# EAGLE design PiZero-RAK (EAGLE 7.7.0)
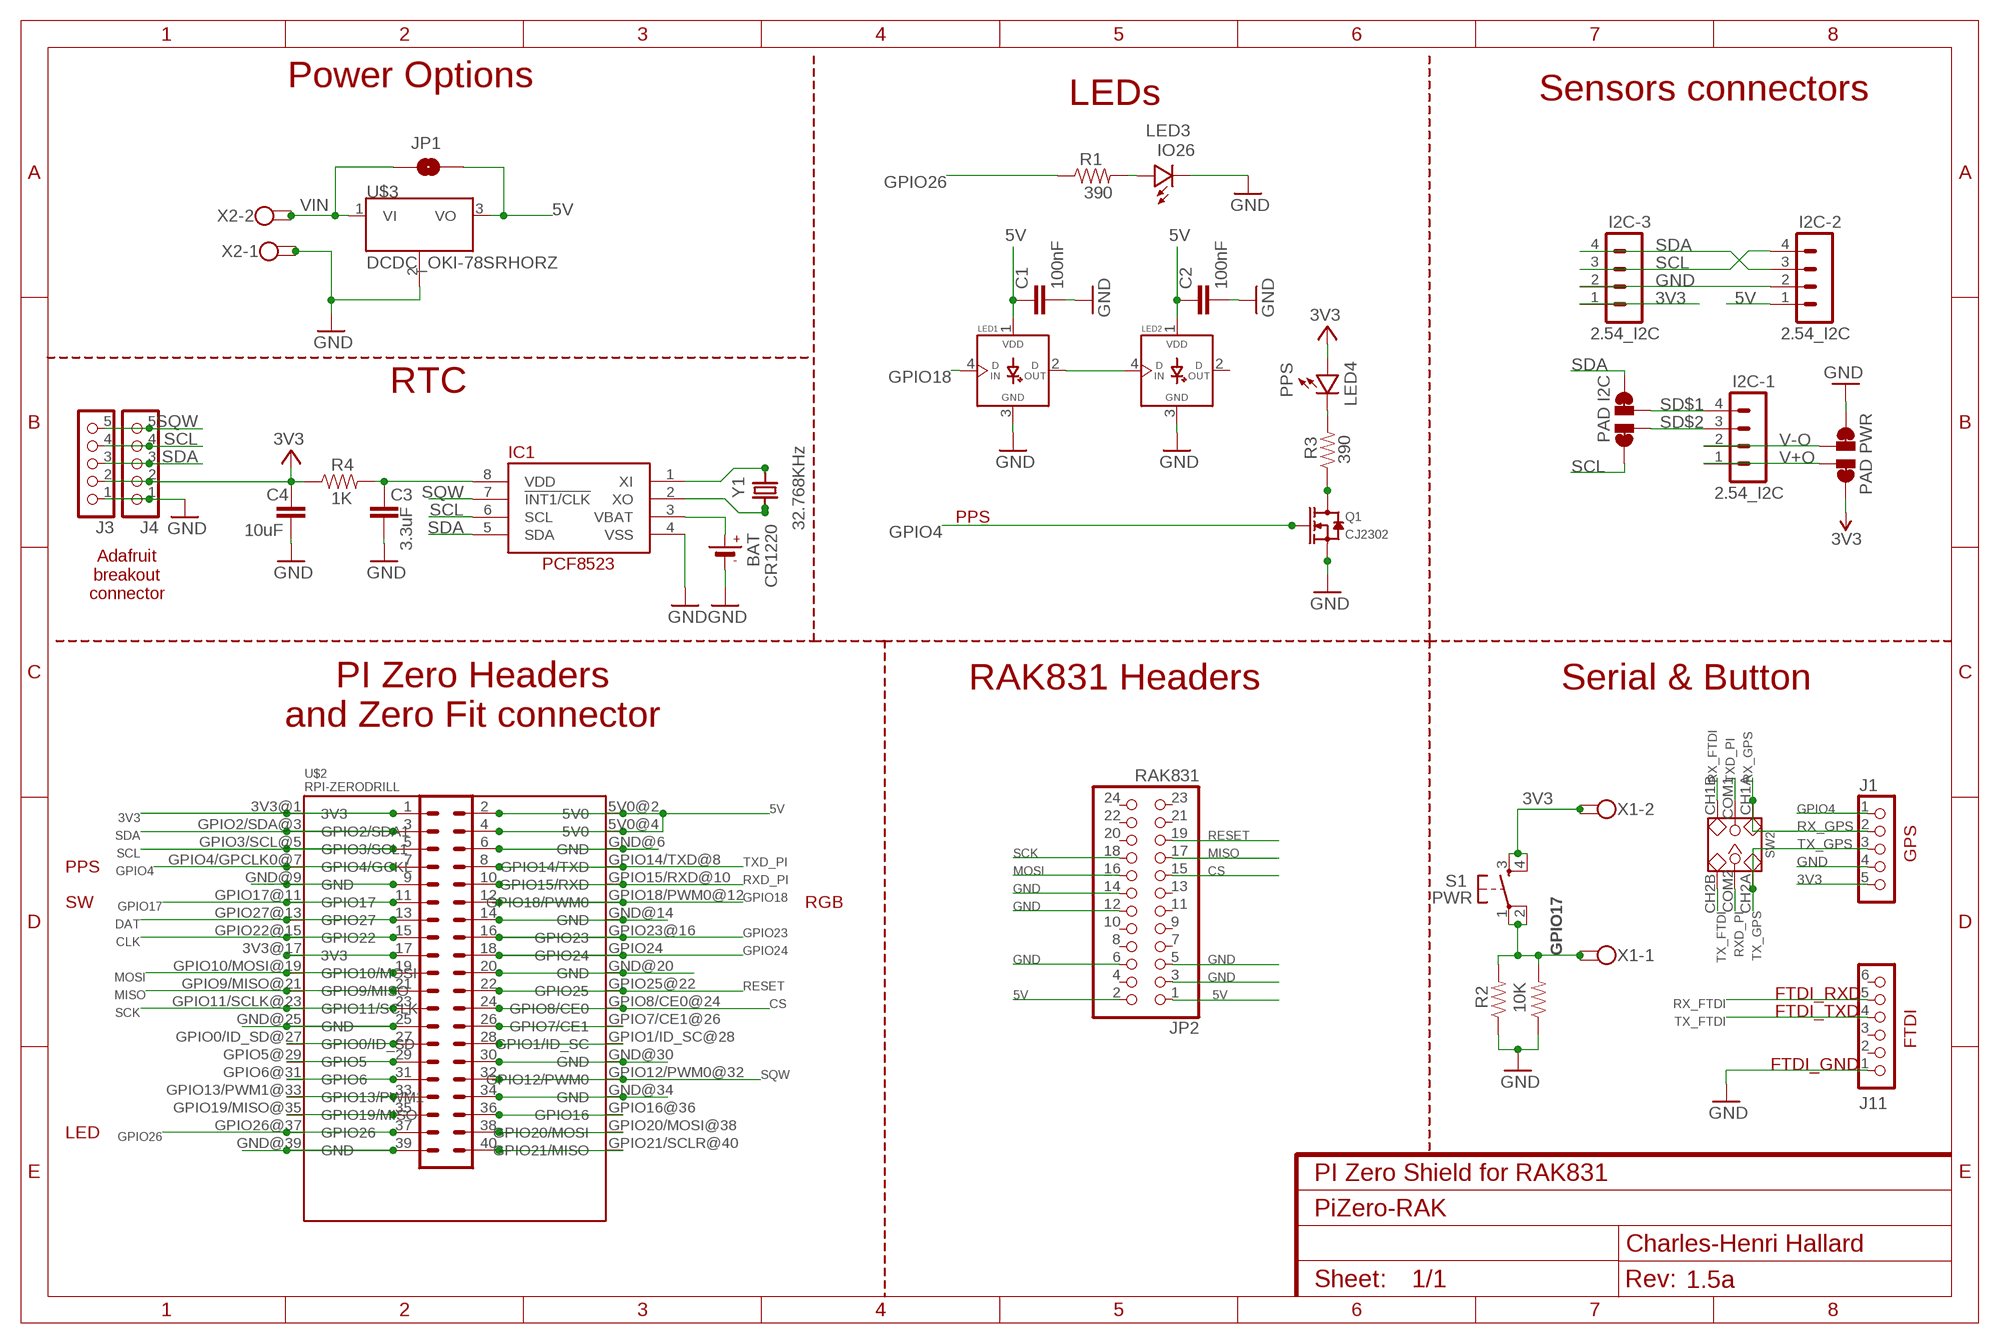
[diagram p0: schematic, sheet 1]
NAME (FRAME-A4L): CNAME: PI Zero Shield for RAK831; CREVISION: 1.5a; DESIGNER: Charles-Henri Hallard

## Parts
BAT  CR1220  BATTERYCR1220_SMT  [CR1220]
C1  100nF  CAP0805-CAP-LARGEPADS  [0805-CAP-LARGEPADS]
C2  100nF  CAP0805-CAP-LARGEPADS  [0805-CAP-LARGEPADS]
C3  3.3uF  CAP0805-CAP-LARGEPADS  [0805-CAP-LARGEPADS]
C4  10uF  CAP0805-CAP-LARGEPADS  [0805-CAP-LARGEPADS]
I2C-1  2.54_I2C  CON_HEADER_1X04'NO_LOCK'  [1X04_NO_LOCK]
I2C-2  2.54_I2C  CON_HEADER_1X04'NO_LOCK'  [1X04_NO_LOCK]
I2C-3  2.54_I2C  CON_HEADER_1X04'NO_LOCK'  [1X04_NO_LOCK]
IC1  PCF8523  RTC_PCF8523T  [SOIC8_150MIL]
J1  CON_HEADER_1X05-PTH  [M1X5]
J2  CONN_20X2HLE  [2X20-HLE]
J3  CON_HEADER_1X05-PTH  [M1X5]
J4  CON_HEADER_1X05-PTH  [M1X5]
J11  CON_HEADER_1X06-PTH  [M1X6]
JP1  JUMPER-PAD-2-NOYES_SILK  [PAD-JUMPER-2-NO_YES_SILK]
JP2  RAK831  PINHD-2X12  [2X12]
LED1  WS2812BLONG  [WS2812B-LONG]
LED2  WS2812BLONG  [WS2812B-LONG]
LED3  IO26  LED0805-LARGE  [0805-LED-LARGEPADS]
LED4  PPS  LED0805-LARGE  [0805-LED-LARGEPADS]
Q1  CJ2302  SMD-MOSFET-N-CH-20V-2.1A-CJ2302(SOT-23)  [SOT-23]
R1  390  RESISTOR0805-RES  [0805-RES]
R2  10K  RESISTORPTH-1/4W  [AXIAL-0.4]
R3  390  RESISTOR0805-RES  [0805-RES]
R4  1K  RESISTOR0805-RES  [0805-RES]
R105  RESISTOR0805-RES  [0805-RES]
S1  PWR  TACTILE-SWITCH-PTH  [TAC-SWITCH-PTH]
SW2  DIP-TOGGLE-SWITCH-2CH-(2X3P-2.54)  [SW6-2.54-9.0X3.5X3.2+2.0MM]
U$2  RPI-ZERODRILL  [RPI-ZERO-DRILLS]
U$3  DCDC_OKI-78SRHORZ  [OKI-78SRH]
U$4  PAD PWR  PAD-JUMPER-SWAPSWAP  [PAD-JUMPER-SWAP]
U$5  PAD I2C  PAD-JUMPER-SWAPSWAP  [PAD-JUMPER-SWAP]
X1  SPTAF_23.5  [FFKV2_35]
X2  SPTAF_25.0MM  [SPTAF_2X50]
Y1  32.768KHz  CRYSTALTC26H  [TC26H]
Y2  CRYSTAL8X3.8SMT  [CRYSTAL_8X3.8]

## Nets
3V3: C4.1 I2C-3.1 J1.5 J2.1 J3.2 J4.2 LED4.PLUS R4.1 S1.3 S1.4 U$2.3V3@1(3V3) U$4.4 U$4.44 X1.2 X1.2A
3V3@17: J2.17 U$2.3V3@17(3V3)
5V: C1.1 C2.1 I2C-2.1 J2.2 J2.4 JP1.2 JP2.1 JP2.2 LED1.1(VDD) LED2.1(VDD) U$2.5V0@2(5V0) U$2.5V0@4(5V0) U$3.3(VO)
CLK: J2.15 U$2.GPIO22@15(GPIO22)
CS: J2.24 JP2.15 U$2.GPIO8/CE0@24(GPIO8/CE0)
DAT: J2.13 U$2.GPIO27@13(GPIO27)
GND: BAT.- C1.2 C2.2 C3.2 C4.2 I2C-2.2 I2C-3.2 IC1.4(VSS) J1.4 J2.6 J2.9 J2.14 J2.20 J2.25 J2.30 J2.34 J2.39 J3.1 J4.1 J11.1 JP2.3 JP2.5 JP2.6 JP2.12 JP2.14 LED1.3(GND) LED2.3(GND) LED3.MINUS Q1.2(S) R2.P$1 R105.1 U$2.GND@6(GND) U$2.GND@9(GND) U$2.GND@14(GND) U$2.GND@20(GND) U$2.GND@25(GND) U$2.GND@30(GND) U$2.GND@34(GND) U$2.GND@39(GND) U$3.2(GND) U$4.1 U$4.11 X2.1 X2.1A
GPIO4: J1.1 J2.7 Q1.1(G) U$2.GPIO4/GPCLK0@7(GPIO4/GCKL)
GPIO17: J2.11 R2.P$2 R105.2 S1.1 S1.2 U$2.GPIO17@11(GPIO17) X1.1 X1.1A
GPIO18: J2.12 LED1.4(DIN) U$2.GPIO18/PWM0@12(GPIO18/PWM0)
GPIO19: J2.35 U$2.GPIO19/MISO@35(GPIO19/MISO)
GPIO23: J2.16 U$2.GPIO23@16(GPIO23)
GPIO24: J2.18 U$2.GPIO24
GPIO26: J2.37 R1.1 U$2.GPIO26@37(GPIO26)
MISO: J2.21 JP2.17 U$2.GPIO9/MISO@21(GPIO9/MISO)
MOSI: J2.19 JP2.16 U$2.GPIO10/MOSI@19(GPIO10/MOSI)
N$14: J2.26 U$2.GPIO7/CE1@26(GPIO7/CE1)
N$16: LED3.PLUS R1.2
N$26: IC1.1(XI) Y1.1 Y2.P$4
N$27: Q1.3(D) R3.1
N$28: J2.28 U$2.GPIO1/ID_SC@28(GPIO1/ID_SC)
N$30: J2.36 U$2.GPIO16@36(GPIO16)
N$31: J2.38 U$2.GPIO20/MOSI@38(GPIO20/MOSI)
N$32: J2.40 U$2.GPIO21/SCLR@40(GPIO21/MISO)
N$33: J2.27 U$2.GPIO0/ID_SD@27(GPIO0/ID_SD)
N$34: J2.29 U$2.GPIO5@29(GPIO5)
N$35: J2.31 U$2.GPIO6@31(GPIO6)
N$36: J2.33 U$2.GPIO13/PWM1@33(GPIO13/PWM1)
N$37: LED4.MINUS R3.2
N$38: IC1.2(XO) Y1.2 Y2.P$1
N$39: LED1.2(DOUT) LED2.4(DIN)
RESET: J2.22 JP2.19 U$2.GPIO25@22(GPIO25)
RX_FTDI: J11.5 SW2.CH1B
RX_GPS: J1.2 SW2.CH1A
RXD_PI: J2.10 SW2.COM2 U$2.GPIO15/RXD@10(GPIO15/RXD)
SCK: J2.23 JP2.18 U$2.GPIO11/SCLK@23(GPIO11/SCLK)
SCL: I2C-2.4 I2C-3.3 IC1.6(SCL) J2.5 J3.4 J4.4 U$2.GPIO3/SCL@5(GPIO3/SCL1) U$5.1 U$5.11
SD$1: I2C-1.4 U$5.3
SD$2: I2C-1.3 U$5.2
SDA: I2C-2.3 I2C-3.4 IC1.5(SDA) J2.3 J3.3 J4.3 U$2.GPIO2/SDA@3(GPIO2/SDA1) U$5.4 U$5.44
SQW: IC1.7(!INT1/CLK) J2.32 J3.5 J4.5 U$2.GPIO12/PWM0@32(GPIO12/PWM0)
TX_FTDI: J11.4 SW2.CH2B
TX_GPS: J1.3 SW2.CH2A
TXD_PI: J2.8 SW2.COM1 U$2.GPIO14/TXD@8(GPIO14/TXD)
V+O: I2C-1.1 U$4.3
V-O: I2C-1.2 U$4.2
VBAT: BAT.+$1(+) IC1.3(VBAT)
VDD: C3.1 IC1.8(VDD) R4.2
VIN: JP1.1 U$3.1(VI) X2.2 X2.2A
Unconnected: J11.2 J11.3 J11.6 JP2.4 JP2.7 JP2.8 JP2.9 JP2.10 JP2.11 JP2.13 JP2.20 JP2.21 JP2.22 JP2.23 JP2.24 LED2.2(DOUT)

## Notes on the sheet
- Power Options
- LEDs | Sensors connectors
- RTC
- PPS
- Adafruit
  breakout
  connector
- Serial & Button
- RAK831 Headers
- PI Zero Headers
  and Zero Fit connector
- GPS
- PPS
- SW | RGB
- FTDI_RXD
- FTDI_TXD
- FTDI
- FTDI_GND
- LED

## Library data of the parts
BAT = microbuilder:BATTERY: CR1220 SMT - Digikey: 3001K-ND CD2032 BAT-HLD-001 - Digikey: BAT-HLD-001-ND
C1-C4 = _c2h:CAP: Capacitor Standard 0603 ceramic capacitor, and 0.1" leaded capacitor.
I2C-1-I2C-3 = _c2h:CON_HEADER_1X04
IC1 = microbuilder:RTC_PCF8523
J1 J3 J4 = dp_devices:CON_HEADER_1X05
J2 = _c2h:CONN_20X2: Multi connection point. Often used as Generic Header-pin footprint for 0.1 inch spaced/style header connections On any of the 0.1 inch spaced packages, you can populate with these: Break Away Headers - Straight <https://www.sparkfun.com/products/116> (PRT-00116) Break Away Male Headers - Right Angle <https://www.sparkfun.com/products/553> (PRT-00553) Female Headers <https://www.sparkfun.com/products/115> (PRT-00115) Break Away Headers - Machine Pin <https://www.sparkfun.com/products/117> (PRT-00117) Break Away Female Headers - Swiss Machine Pin <https://www.sparkfun.com/products/743> (PRT-00743)
J11 = _c2h:CON_HEADER_1X06
JP1 = SparkFun-Passives:JUMPER-PAD-2-NO
JP2 = pinhead:PINHD-2X12: PIN HEADER
LED1 LED2 = _c2h:WS2812B
LED3 LED4 = _c2h:LED
Q1 = Seeed-Transistor:SMD-MOSFET-N-CH-20V-2.1A-CJ2302(SOT-23): 305030015; MPN: CJ2302
R1-R4 R105 = _c2h:RESISTOR: Resistor Basic schematic elements and footprints for 0603, 1206, and PTH resistors.
S1 = GeekAmmo:TACTILE-SWITCH: Tactile Switch 4 Pins, SPST NO
SW2 = Seeed-Switch:DIP-TOGGLE-SWITCH-2CH-(2X3P-2.54): 311010004; MPN: MS-22D18 G2 ROHS
U$2 = tobias:RPI-ZERO
U$3 = _c2h:DCDC_OKI-78SR: 4.95W DC/DC Converter Manufacturer: Murata Part Number: OKI-78SR-5/1.5-W36H-C OKI-78SR-3.3/1.5-W36H-C
U$4 U$5 = _c2h:PAD-JUMPER-SWAP
X1 X2 = _c2h:SPTAF_2: PHOENIX
Y1 = adafruit:CRYSTAL: CRYSTAL; OC_FARNELL: unknown; OC_NEWARK: unknown
Y2 = microbuilder:CRYSTAL: Crystals HC49UP - Surface Mount Crystal 4.0MHz 18pF +/-30ppm Surface Mount Crystal [Digikey: 535-9857-1-ND] 12.0 MHz Surface Mount Crystal [Digikey: 535-9869-6-ND] 25.0 MHz Surface Mount Crystal [Digikey: 535-9078-1-ND] 2.5 x 2.0mm - MEMs SMT Crystal 16.0 MHz 10pF 20ppm 2.5 x 2.0mm Crystal [Digikey -40-85°C: 535-10923-1-ND] 3.2 x 2.5mm - MEMs SMT Crystal 12.0 MHz 8pF 15ppm 3.2 x 2.5mm Crystal [Digikey: -10-70°C: 644-1047-1-ND -40-125°C: 644-1128-1-ND] 16.0 MHz 8pF 15ppm 3.2 x 2.5mm Crystal [Digikey: -10-70°C: 644-1049-1-ND -40-125°C: 644-1129-2-ND] 16.0 MHz 10pF 10ppm 3.2 x 2.5mm Crystal [Digikey: 644-1100-1-ND] 27.12 MHz 18pF 30ppm 3.2 x 2.5mm Crystal [Digikey: 887-1424-1-ND] 27.12MHz 10pF 10ppm 3.2 x 2.5mm Crystal [Digikey: 887-1329-1-ND] 4.9 x 1.8mm - MEMs SMT Crystal 32.768 KHz 12.5pF 20ppm 4.9 x 1.8mm Crystal [Digikey: SE2415CT-ND] 8.0 x 3.8mm - Surface Mount Crystal 32.768kHz 12.5pF 20ppm -40°C-85°C [Digikey: 535-9166-2-ND] Cylinder 32.768KHz Cylinder Crystal (2x6mm body) [Ex. Digikey: 300-8341-2-ND]

## Board
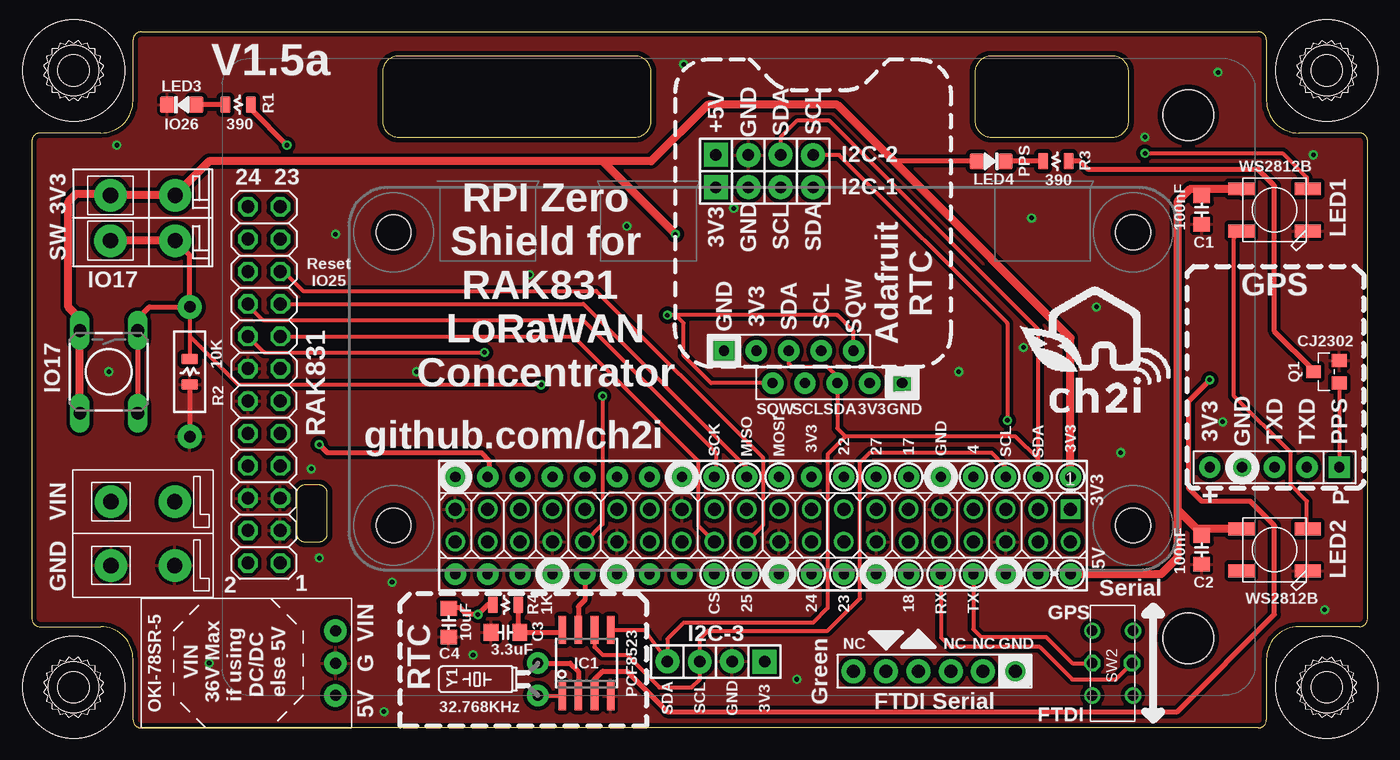
[diagram p1: board, top side]
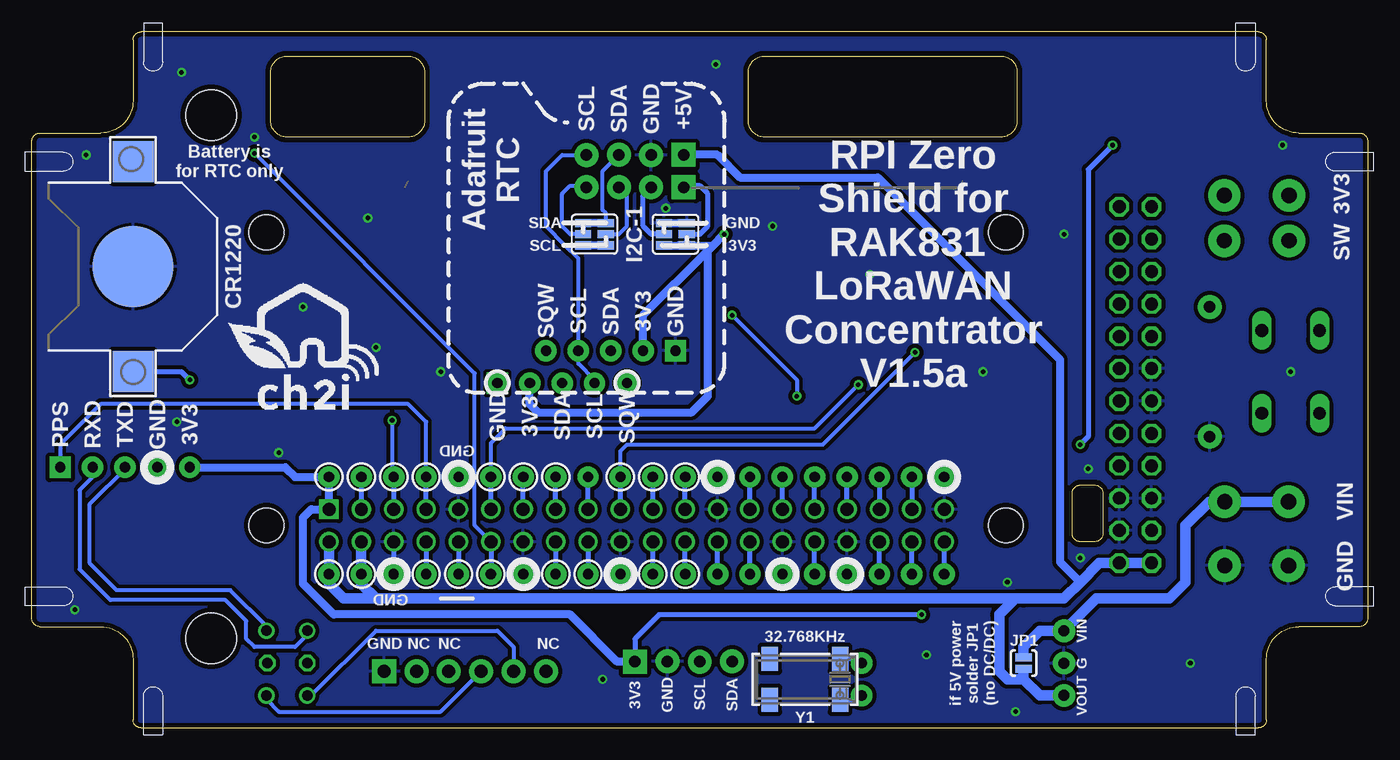
[diagram p2: board, bottom side, seen from below]

Size 104.78 x 54.61 mm. Coordinates in mm from the lower left corner, seen from the top.
Outline: 47.31,52.7 28.77,52.7 arc90 27.5,51.43 27.5,47.62 arc90 28.77,46.35 47.31,46.35 arc90 48.58,47.62 48.58,51.43 arc90 47.31,52.7
Outline: 84.77,52.7 75.25,52.7 arc90 73.98,51.43 73.98,47.62 arc90 75.25,46.35 84.77,46.35 arc90 86.04,47.62 86.04,51.43 arc90 84.77,52.7
Outline: 22.54,19.05 21.4,19.05 arc90 20.76,18.41 20.76,15.24 arc90 21.4,14.6 22.54,14.6 arc90 23.18,15.24 23.18,18.41 arc90 22.54,19.05
Copper layers (1*16): Top 0.0356mm / dielectric 1.5011mm / Bottom 0.0356mm
Design rules "PCBs_io": minimum track width 6mil, minimum drill 13mil, track to track 6mil, track to pad 6mil, pad to pad 6mil, via to via 6mil, smd to smd 6mil, copper to edge 15mil, drill to drill 6mil, minimum pad ring 7mil, minimum via ring 7mil, stop-mask expansion 3mil, vias tented up to drill 40mil, thermal gap 10mil
Holes 4 mm at 90.72,7.02 90.72,48.07

### Footprints (pad centres in the part's own frame; a part is rotated, then mirrored left to right if it is on the bottom)
CR1220 = smd 3.2 x 3.2: +$1 -8.225,0; +$2 8.225,0 | smd 6.35 x 6.35: - 0,0
0805-CAP-LARGEPADS = smd 1.156 x 1.3: 1 -1.127,0; 2 1.127,0
1X04_NO_LOCK = drill 0.9 pad 1.88 square: 1 -3.816,-0.121 | drill 0.9 pad 1.88: 2 -1.27,-0.133; 3 1.27,-0.121; 4 3.81,-0.133
SOIC8_150MIL = smd 0.6 x 2.2: 1 -1.905,-2.6; 2 -0.635,-2.6; 3 0.635,-2.6; 4 1.905,-2.6; 5 1.905,2.6; 6 0.635,2.6; 7 -0.635,2.6; 8 -1.905,2.6
M1X5 = drill 0.8 pad 1.676 square: 1 -5.08,0 | drill 0.8 pad 1.676: 2 -2.54,0; 3 0,0; 4 2.54,0; 5 5.08,0
2X20-HLE = drill 0.8 pad 1.676: 1 -24.13,-3.81; 2 -24.13,3.81; 3 -21.59,-3.81; 4 -21.59,3.81; 5 -19.05,-3.81; 6 -19.05,3.81; 7 -16.51,-3.81; 8 -16.51,3.81; 9 -13.97,-3.81; 10 -13.97,3.81; 11 -11.43,-3.81; 12 -11.43,3.81; 13 -8.89,-3.81; 14 -8.89,3.81; 15 -6.35,-3.81; 16 -6.35,3.81; 17 -3.81,-3.81; 18 -3.81,3.81; 19 -1.27,-3.81; 20 -1.27,3.81; 21 1.27,-3.81; 22 1.27,3.81; 23 3.81,-3.81; 24 3.81,3.81; 25 6.35,-3.81; 26 6.35,3.81; 27 8.89,-3.81; 28 8.89,3.81; 29 11.43,-3.81; 30 11.43,3.81; 31 13.97,-3.81; 32 13.97,3.81; 33 16.51,-3.81; 34 16.51,3.81; 35 19.05,-3.81; 36 19.05,3.81; 37 21.59,-3.81; 38 21.59,3.81; 39 24.13,-3.81; 40 24.13,3.81
M1X6 = drill 1.02 pad 1.88 square: 1 0,0 | drill 1.02 pad 1.88: 2 2.54,0; 3 5.08,0; 4 7.62,0; 5 10.16,0; 6 12.7,0
PAD-JUMPER-2-NO_YES_SILK = smd 0.635 x 1.27: 1 -0.45,0; 2 0.45,0
2X12 = drill 1.016 octagon: 1 -13.97,-1.27; 2 -13.97,1.27; 3 -11.43,-1.27; 4 -11.43,1.27; 5 -8.89,-1.27; 6 -8.89,1.27; 7 -6.35,-1.27; 8 -6.35,1.27; 9 -3.81,-1.27; 10 -3.81,1.27; 11 -1.27,-1.27; 12 -1.27,1.27; 13 1.27,-1.27; 14 1.27,1.27; 15 3.81,-1.27; 16 3.81,1.27; 17 6.35,-1.27; 18 6.35,1.27; 19 8.89,-1.27; 20 8.89,1.27; 21 11.43,-1.27; 22 11.43,1.27; 23 13.97,-1.27; 24 13.97,1.27
WS2812B-LONG = smd 2.032 x 1.016: 1 2.609,-1.65; 2 2.609,1.65; 3 -2.609,1.65; 4 -2.609,-1.65
0805-LED-LARGEPADS = smd 1.156 x 1.3: MINUS -1.127,0; PLUS 1.127,0
SOT-23 = smd 1.016 x 1.143: 1 -0.889,-1.016; 2 0.889,-1.016; 3 0,1.016
0805-RES = smd 0.8 x 1.3: 1 -1,0; 2 1,0
AXIAL-0.4 = drill 0.9 pad 1.88: P$1 -5.08,0; P$2 5.08,0
TAC-SWITCH-PTH = drill 1.016 pad 1.524 long: 1 -3.251,2.261; 2 3.251,2.261; 3 -3.251,-2.261; 4 3.251,-2.261
SW6-2.54-9.0X3.5X3.2+2.0MM = drill 0.813 pad 1.27: CH1A -2.54,-1.6; CH1B 2.54,-1.6; CH2A -2.54,1.6; CH2B 2.54,1.6 | drill 0.813 pad 1.27 octagon: COM1 0,-1.6; COM2 0,1.524
RPI-ZERO-DRILLS = drill 1.016 square: 3V3@1 8.89,25.4 | drill 1.016: 3V3@17 29.21,25.4; 5V0@2 8.89,27.94; 5V0@4 11.43,27.94; GND@6 13.97,27.94; GND@9 19.05,25.4; GND@14 24.13,27.94; GND@20 31.75,27.94; GND@25 39.37,25.4; GND@30 44.45,27.94; GND@34 49.53,27.94; GND@39 57.15,25.4; GPIO0/ID_SD@27 41.91,25.4; GPIO1/ID_SC@28 41.91,27.94; GPIO2/SDA@3 11.43,25.4; GPIO3/SCL@5 13.97,25.4; GPIO4/GPCLK0@7 16.51,25.4; GPIO5@29 44.45,25.4; GPIO6@31 46.99,25.4; GPIO7/CE1@26 39.37,27.94; GPIO8/CE0@24 36.83,27.94; GPIO9/MISO@21 34.29,25.4; GPIO10/MOSI@19 31.75,25.4; GPIO11/SCLK@23 36.83,25.4; GPIO12/PWM0@32 46.99,27.94; GPIO13/PWM1@33 49.53,25.4; GPIO14/TXD@8 16.51,27.94; GPIO15/RXD@10 19.05,27.94; GPIO16@36 52.07,27.94; GPIO17@11 21.59,25.4; GPIO18/PWM0@12 21.59,27.94; GPIO19/MISO@35 52.07,25.4; GPIO20/MOSI@38 54.61,27.94; GPIO21/SCLR@40 57.15,27.94; GPIO22@15 26.67,25.4; GPIO23@16 26.67,27.94; GPIO24 29.21,27.94; GPIO25@22 34.29,27.94; GPIO26@37 54.61,25.4; GPIO27@13 24.13,25.4 | hole 2.75: 3.99,3.66; 3.99,26.66; 61.99,3.66; 61.99,26.66
OKI-78SRH = drill 0.864 pad 1.778: 1 2.54,0; 2 0,0; 3 -2.54,0
PAD-JUMPER-SWAP = smd 0.635 x 1.27: 1 -0.876,0.889; 2 0,-0.889; 3 0,0.889; 4 0.876,-0.889; 11 -0.876,-0.889; 44 0.876,0.889
FFKV2_35 = drill 1.194 pad 2.54: 1 -1.778,-2.032; 1A -1.778,3.048; 2 1.778,-2.032; 2A 1.778,3.048
SPTAF_2X50 = drill 1.2 pad 2.54: 1 -2.5,-2; 1A -2.5,3; 2 2.5,-2; 2A 2.5,3
TC26H = drill 0.813 pad 1.676: 1 -1.27,0; 2 1.27,0
CRYSTAL_8X3.8 = smd 1.3 x 1.9: P$1 -2.75,-1.6; P$2 2.75,-1.6; P$3 2.75,1.6; P$4 -2.75,1.6

### Placement (x,y rotation side)
BAT  96.84,36.2 90 bottom
C1  91.76,40.64 270 top
C2  91.76,13.97 270 top
C3  37.15,7.49 180 top
C4  32.7,8.25 270 top
I2C-1  57.47,42.55 0 top
I2C-2  57.47,45.09 0 top
I2C-3  53.66,5.08 180 top
IC1  43.5,5.08 0 top
J1  97.47,20.45 180 top
J2  57.34,15.88 180 top
J3  59.37,29.59 0 top
J4  63.18,27.05 180 top
J11  77.15,4.44 180 top
JP1  26.99,5.08 270 bottom
JP2  18.22,26.91 90 top
LED1  97.47,40.64 180 top
LED2  97.47,13.97 180 top
LED3  11.75,48.89 0 top
LED4  75.25,44.45 180 top
Q1  101.54,27.94 90 top
R1  16.19,48.89 180 top
R2  12.38,27.94 90 top
R3  80.33,44.45 180 top
R4  37.15,9.65 0 top
R105  12.38,27.94 90 top
S1  6.03,27.94 270 top
SW2  84.77,5.08 270 top
U$1  [LOGO_CH2I_110MM]  84.01,27.69 0 top
U$2  90.36,42.55 180 top
U$3  23.81,5.08 90 top
U$4  54.29,38.73 270 bottom
U$5  60.64,38.73 90 bottom
U$9  [LOGO_CH2I_110MM]  82.87,27.94 0 bottom
U$10  [ENCLOSURE_1591B]  52.39,27.3 0 top
X1  9.21,40 90 top
X2  9.21,15.24 90 top
Y1  39.69,3.81 90 top
Y2  44.13,3.81 180 bottom

### Tracks (layer width: path | path; a pad name or v marks a point on that pad's centre or on a via)
3V3  (via drill 0.36 pad 0.71)
  Top 0.406: 68.53,43.55 68.9,43.18 | 32.85,9.52 C4.1 32.72,9.4 33.59,9.4 34.1,8.89 v34.99,8.89 35.75,9.65 R4.1 | LED4.PLUS 67.63,44.45
  Top 0.61: 44.77,44.45 48.58,44.45 53.02,48.89 63.18,48.89 67.63,44.45 68.9,43.18 81.47,30.61 J2.1 | 44.77,44.45 13.91,44.45 X1.2 X1.2A 6.03,41.91 3.49,41.91 2.86,41.27 2.86,33.02 3.77,32.11 S1.3 S1.4 | v50.48,38.73 44.77,44.45
  Bottom 0.305: U$4.44 U$4.4
  Bottom 0.406: I2C-3.1 57.47,5.84 57.47,6.98 55.56,8.89 v34.99,8.89
  Bottom 0.61: U$4.44 51.36,37.86 | 51.36,37.86 v50.48,38.73 | I2C-3.1 58.86,5.2 62.55,8.89 81.09,8.89 83.5,11.3 83.5,16.51 82.87,17.14 U$2.3V3@1 J2.1 84.14,19.68 84.9,20.45 J1.5 | J3.2 56.83,32.38 51.75,37.46 | 51.75,37.46 51.75,26.03 53.02,24.76 65.09,24.76 65.72,25.4 J4.2 | 51.75,37.46 51.36,37.86
3V3@17
  Bottom 0.406: U$2.3V3@17 J2.17
5V
  Top 0.406: 94.93,41.91 94.93,42.22 LED1.1 94.93,42.36 | 94.93,15.24 94.93,15.55 LED2.1
  Top 0.61: 89.85,17.14 89.85,41.27 90.87,42.29 91.76,42.29 | 89.85,17.14 89.85,13.33 88.58,12.06 J2.2 | LED2.1 91.76,15.62 | 91.76,15.62 91.38,15.62 89.85,17.14 | C2.1 91.76,15.62 | LED1.1 91.76,42.29 | C1.1 91.76,42.29
  Bottom 0.61: JP1.2 26.99,4.44 | I2C-2.1 51,44.96 49.21,43.18 38.42,43.18 24.13,28.89 24.13,13.02 22.54,11.43
  Bottom 0.813: 77.79,10.16 78.93,11.3 J2.4 U$2.5V0@4 | U$2.5V0@2 J2.2 81.47,11.3 80.33,10.16 77.79,10.16 | JP2.2 JP2.1 21.03,12.94 22.54,11.43 23.81,10.16 26.99,10.16 27.62,10.16 | U$3.3 25.72,2.54 26.99,3.81 | 26.99,4.44 26.99,3.81 | 27.62,10.16 28.89,8.89 28.89,4.44 28.26,3.81 26.99,3.81 | 77.79,10.16 27.62,10.16
CLK
  Bottom 0.406: U$2.GPIO22@15 J2.15
CS
  Top 0.305: JP2.15 42.49,30.72 52.26,20.95 52.26,15.88 U$2.GPIO8/CE0@24
  Bottom 0.406: J2.24 U$2.GPIO8/CE0@24
DAT
  Bottom 0.406: U$2.GPIO27@13 J2.13
GND  (via drill 0.36 pad 0.71)
  Top 0.406: R105.1 R2.P$1
  Bottom 0.305: U$4.11 U$4.1
  Bottom 0.406: U$2.GND@6 J2.6
  other vias: 51.12,52.07 39.05,35.56 87.31,46.35 93.03,51.43 101.41,9.27 27.62,1.27 28.26,11.43 30.16,27.94 72.71,27.94 77.79,29.84 46.67,39.37 85.41,21.59 78.42,40 23.81,38.73 6.67,45.72 100.52,44.96 13.91,5.08 6.03,27.94 83.5,33.02 55.05,40.77 22.54,13.33 21.91,20.32 93.41,24 34.61,5.71 60.01,3.81
  pour Bottom (isolate 0.305): -2.22,-1.27 105.73,-1.27 105.73,55.88 -2.22,55.88
  pour Top (isolate 0.305): -1.59,55.24 105.09,55.24 105.09,-0.64 -1.59,-0.64
GPIO4
  Top 0.305: Q1.1 J1.1
  Bottom 0.305: J2.7 73.85,24 75.25,25.4 99.38,25.4 102.55,22.22 J1.1
  Bottom 0.406: U$2.GPIO4/GPCLK0@7 J2.7
GPIO17  (via drill 0.36 pad 0.71)
  Top 0.305: R105.2 R2.P$2 12.38,30.73 16.19,26.92 v39.94,26.92
  Top 0.406: S1.2 S1.1 8.29,32.11 9.21,33.02 R2.P$2 12.38,37.08 X1.1 11.37,38.1
  Top 0.61: X1.1 X1.1A
  Bottom 0.305: J2.11 68.77,22.35 67.63,23.49 43.37,23.49 v39.94,26.92
  Bottom 0.406: U$2.GPIO17@11 J2.11
GPIO18  (via drill 0.36 pad 0.71)
  Top 0.305: v87.31,45.09 98.11,45.09 100.01,43.18 100.01,42.36 LED1.4
  Top 0.406: 99.83,42.55 LED1.4
  Bottom 0.305: U$2.GPIO18/PWM0@12 70.04,15.88 70.04,27.81 v87.31,45.09
  Bottom 0.406: U$2.GPIO18/PWM0@12 J2.12
GPIO19
  Bottom 0.406: J2.35 U$2.GPIO19/MISO@35
GPIO23
  Bottom 0.406: U$2.GPIO23@16 J2.16
GPIO24
  Bottom 0.406: U$2.GPIO24 J2.18
GPIO26  (via drill 0.36 pad 0.71)
  Top 0.406: v22.54,22.22 23.18,21.59 35.24,21.59 35.88,20.95 35.88,19.81 J2.37 | R1.1 17.19,48.53 v20,45.72
  Bottom 0.406: J2.37 U$2.GPIO26@37 | v22.54,22.22 21.91,22.86 21.91,43.81 v20,45.72
MISO
  Top 0.305: J2.21 56.07,20.45 43.26,33.26 JP2.17
  Bottom 0.406: U$2.GPIO9/MISO@21 J2.21
MOSI  (via drill 0.36 pad 0.71)
  Top 0.305: JP2.16 16.97,30.72 18.22,29.46 v35.5,29.46
  Bottom 0.305: J2.19 58.61,21.72 58.1,22.22 42.74,22.22 v35.5,29.46
  Bottom 0.406: U$2.GPIO10/MOSI@19 J2.19
N$14
  Bottom 0.406: J2.26 U$2.GPIO7/CE1@26
N$16
  Top 0.406: R1.2 LED3.PLUS
N$26
  Top 0.305: IC1.1 39.75,2.48 Y1.1
  Bottom 0.305: Y2.P$4 40.02,2.21 Y1.1
N$27
  Top 0.406: Q1.3 100.52,28.07 97.47,31.12 97.47,42.55 96.2,43.81 82.87,43.81 82.23,44.45 R3.1
N$28
  Bottom 0.406: J2.28 U$2.GPIO1/ID_SC@28
N$30
  Bottom 0.406: J2.36 U$2.GPIO16@36
N$31
  Bottom 0.406: J2.38 U$2.GPIO20/MOSI@38
N$32
  Bottom 0.406: J2.40 U$2.GPIO21/SCLR@40
N$33
  Bottom 0.406: U$2.GPIO0/ID_SD@27 J2.27
N$34
  Bottom 0.406: U$2.GPIO5@29 J2.29
N$35
  Bottom 0.406: U$2.GPIO6@31 J2.31
N$36
  Bottom 0.406: U$2.GPIO13/PWM1@33 J2.33
N$37
  Top 0.406: R3.2 LED4.MINUS
N$38
  Top 0.406: Y1.2 42.23,5.08 42.86,4.44 IC1.2
  Bottom 0.305: Y2.P$1 40.02,5.41 Y1.2
N$39
  Top 0.305: 100.01,15.69 100.01,17.78 98.74,19.05 98.74,21.59 94.3,26.03 94.3,38.42 LED1.2
  Top 0.406: 95.12,38.73 LED1.2 | 99.83,15.88 100.01,15.69 LED2.4
RESET
  Top 0.305: JP2.19 19.76,35.8 21.27,34.29 44.26,34.29 57.34,21.21 57.34,15.88 U$2.GPIO25@22
  Bottom 0.406: J2.22 U$2.GPIO25@22
RX_FTDI
  Bottom 0.305: SW2.CH1B 82.87,2.54 77.79,7.62 68.26,7.62 66.99,6.35 J11.5
RX_GPS
  Bottom 0.305: J1.2 100.01,19.68 101.03,18.67 101.03,12.45 98.62,10.03 89.6,10.03 87.95,8.38 87.95,6.98 87.31,6.35 84.14,6.35 83.17,7.31 SW2.CH1A
RXD_PI
  Top 0.305: J2.10 71.31,7.11 72.07,6.35 79.06,6.35 81.6,3.81 85.03,3.81 SW2.COM2
  Bottom 0.406: U$2.GPIO15/RXD@10 J2.10
SCK
  Top 0.305: JP2.18 16.95,33.16 18.1,32 43.24,32 53.66,21.59 53.66,19.81 J2.23
  Bottom 0.406: U$2.GPIO11/SCLK@23 J2.23
SCL  (via drill 0.36 pad 0.71)
  Top 0.305: I2C-3.3 52.39,6.98 53.02,7.62 62.42,7.62 64.96,10.16 64.96,20.83 65.72,21.59 75.25,21.59 76.39,20.45 J2.5 | U$2.GPIO3/SCL@5 76.39,17.27 | v76.52,24.13 76.52,31.75 63.32,44.95 I2C-2.4 | 52.39,4.44 I2C-3.3 | IC1.6 44.13,6.35 44.77,5.71 46.67,5.71 49.21,3.17 51.75,3.17 52.39,3.81 I2C-3.3
  Bottom 0.305: v76.52,24.13 76.52,19.81 J2.5 | 62.94,37.86 U$5.1 U$5.11 | 62.94,37.86 64.45,39.37 64.45,43.68 63.18,44.95 I2C-2.4 | 62.94,37.86 61.91,36.83 J3.4 61.91,28.57 60.64,27.3 J4.4
  Bottom 0.406: J2.5 U$2.GPIO3/SCL@5
SD$1
  Bottom 0.305: U$5.3 62.55,38.73 63.18,39.37 63.18,41.91 62.55,42.55 61.41,42.55 I2C-1.4
SD$2
  Bottom 0.305: U$5.2 58.74,38.73 58.1,39.37 58.1,41.79 I2C-1.3
SDA
  Top 0.305: U$2.GPIO2/SDA@3 78.93,17.27 | 63.82,22.86 77.15,22.86 78.93,21.08 | 63.82,22.86 62.42,21.46 62.42,9.4 61.28,8.25 51.12,8.25 49.85,6.98 I2C-3.4 48.02,7.68 IC1.5 | J2.3 78.93,21.08 | 78.93,21.08 78.93,31.24 62.55,47.62 60.01,47.62 58.74,46.35 I2C-2.3 | 63.82,22.86 63.18,23.49 J4.3 63.18,27.56 62.42,28.32 59.63,28.32 59.37,28.57 J3.3
  Bottom 0.305: I2C-2.3 60.01,43.69 60.01,40.64 59.75,40.39 U$5.4 U$5.44
  Bottom 0.406: J2.3 U$2.GPIO2/SDA@3
SQW  (via drill 0.36 pad 0.71)
  Top 0.305: J3.5 64.45,31.12 63.18,32.38 50.48,32.38 | 50.48,32.38 v49.85,32.38 | v44.77,26.03 44.77,16 U$2.GPIO12/PWM0@32 | J4.5 53.28,27.05 51.12,29.21 51.12,31.75 50.48,32.38
  Top 0.406: J2.32 43.37,10.03 42.86,9.52 IC1.7
  Bottom 0.305: v49.85,32.38 44.77,27.3 v44.77,26.03
  Bottom 0.406: J2.32 U$2.GPIO12/PWM0@32
TX_FTDI
  Bottom 0.305: SW2.CH2B 86.37,2.23 85.41,1.27 72.71,1.27 J11.4
TX_GPS
  Bottom 0.305: J1.3 97.35,20.45 100.27,17.53 100.27,12.95 98.11,10.79 89.22,10.79 86.37,7.95 SW2.CH2A
TXD_PI
  Top 0.305: J2.8 73.85,7.75 74.49,7.11 79.57,7.11 81.6,5.08 SW2.COM1
  Bottom 0.406: U$2.GPIO14/TXD@8 J2.8
V+O
  Bottom 0.406: U$4.3 52.39,38.73 51.75,39.37 51.75,41.91 52.39,42.55 53.53,42.55 I2C-1.1
V-O
  Bottom 0.406: U$4.2 56.2,38.73 56.83,39.37 56.83,41.78 I2C-1.2
VBAT  (via drill 0.36 pad 0.71)
  Top 0.406: IC1.3 44.13,3.81 44.77,4.44 46.67,4.44 49.85,1.27 89.85,1.27 97.47,8.89 97.47,15.88 95.57,17.78 91.76,17.78 90.74,18.8 90.74,25.65 v92.39,27.3
  Bottom 0.406: v92.39,27.3 93.03,27.94 96.81,27.94 BAT.+$1
VDD
  Top 0.406: 41.53,7.68 IC1.8 41.53,7.49 C3.1 38.15,7.75 R4.2
VIN
  Bottom 0.61: 26.99,5.71 JP1.1
  Bottom 0.813: X2.2A X2.2 | X2.2 11.71,17.74 11.75,17.78 11.25,17.78 X2.2 | X2.2 12.42,17.74 14.29,15.88 14.29,11.43 15.56,10.16 21.27,10.16 U$3.1 25.72,7.62 26.99,6.35 26.99,5.71

### Text on the board
tPlace: V1.5a | +5V | GND | SDA | SCL | I2C-2 | 24 | 23 | WS2812B | I2C-1 | 3V3 | 3V3 | GND | SCL | SDA | SW | Reset / IO25 | RPI Zero / Shield for / RAK831 / LoRaWAN / Concentrator | Adafruit / RTC | GPS | GND | 3V3 | SDA | SCL | SQW | CJ2302 | SQW | SCL | SDA | 3V3 | GND | 3V3 | GND | TXD | TXD | PPS | github.com/ch2i | 3V3 | + | VIN | P | 5V | GND | 2 | 1 | Serial | WS2812B | VIN | GPS | I2C-3 | NC | NC | NC | GND | VIN / 36V Max / if using / DC/DC / else 5V | RTC | OKI-78SR-5 | G | Green | SDA | SCL | GND | 3V3 | 5V | FTDI Serial | FTDI
bPlace: +5V | GND | SDA | SCL | Battery is / for RTC only | Adafruit / RTC | 3V3 | GND | SDA | I2C-1 | SW | 3V3 | SCL | RPI Zero / Shield for / RAK831 / LoRaWAN / Concentrator / V1.5a | GND | 3V3 | SDA | SCL | SQW | SQW | SCL | SDA | 3V3 | GND | 3V3 | GND | TXD | RXD | PPS | VIN | GND | 32.768KHz | NC | NC | NC | GND | if 5V power / solder JP1 / (no DC/DC) | SDA | SCL | GND | 3V3 | Y1
tNames: LED1 | IO17 | IO17 | SCK | MISO | MOSI | 3V3 | GND | SCL | SDA | 3V3 | 22 | 27 | 17 | 4 | LED2 | CS | 25 | 24 | 23 | 18 | RX | TX
bNames: GND | GND